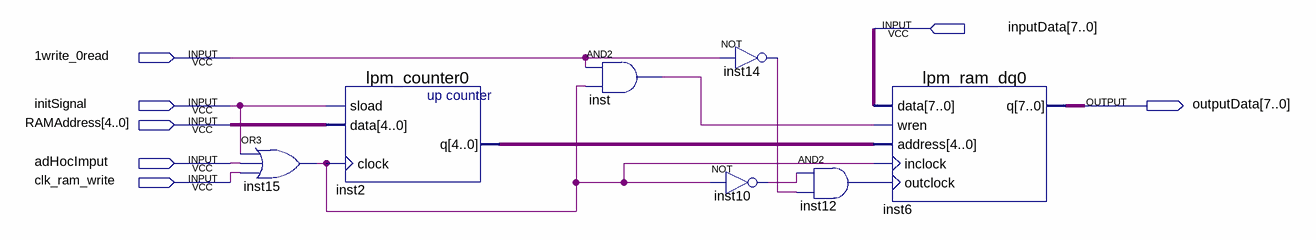
[diagram p0: schematic sheet]
// Quartus schematic RAM.bdf as structural Verilog: 7 symbols, 7 pins
module RAM (
  input  [7:0] inputData,
  input  \1write_0read ,
  input  initSignal,
  input  [4:0] RAMAddress,
  input  adHocImput,
  input  clk_ram_write,
  output [7:0] outputData
);

  wire inst10_out, inst12_out, inst14_out, inst15_out, inst_out;
  wire [4:0] inst2_q;

  or inst15 (inst15_out, initSignal, adHocImput, clk_ram_write);
  lpm_counter0 inst2 (.sload(initSignal), .data(RAMAddress), .clock(inst15_out), .q(inst2_q));
  and inst (inst_out, \1write_0read , inst15_out);
  not inst14 (inst14_out, \1write_0read );
  not inst10 (inst10_out, inst15_out);
  and inst12 (inst12_out, inst10_out, inst14_out);
  lpm_ram_dq0 inst6 (
    .data(inputData), .wren(inst_out), .address(inst2_q), .inclock(inst15_out), .outclock(inst12_out),
    .q(outputData));
endmodule
